# Altium schematic sheet power.SchDoc
size A4
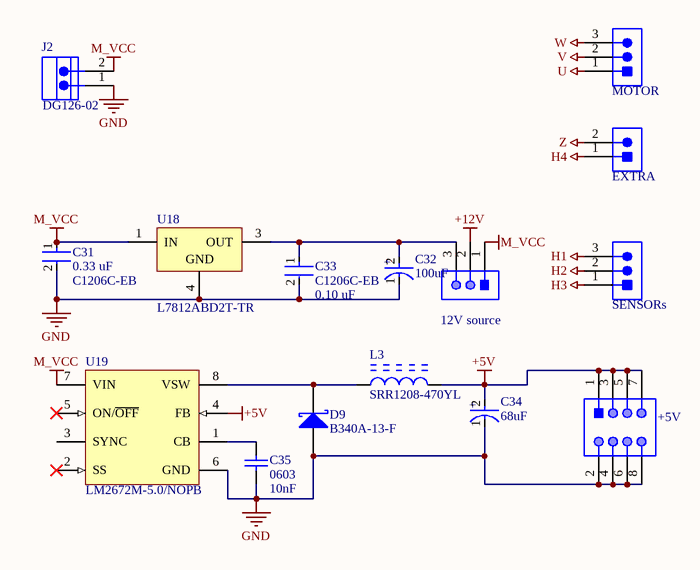
[diagram p0: power.SchDoc]

## Parts
12V_source  61300311121  [61300311121]  (value not drawn)
+5V  61300821121  [61300821121]  (value not drawn)
C31  Capacitance: 0.33 uF  Package: C1206C-EB  [FP-C1206C-EB-IPC_A]  (hidden comment: C1206C334M3VACTU)
C32  Capacitance: 100uF  [FP-PCR1J101MCL1GS-MFG]  (hidden comment: PCR1J101MCL1GS)
C33  Package: C1206C-EB  Capacitance: 0.10 uF  [FP-C1206C-EB-IPC_A]  (hidden comment: C1206C104KARACTU)
C34  Capacitance: 68uF  [FP-PCR1J101MCL1GS-MFG]  (hidden comment: PCR1J101MCL1GS)
C35  value 10nF  Case-EIA: 0603  [CAPC0603(1608)100_M]  (hidden comment: CAP 1nF 16V 0603(1608))
D9  B340A-13-F  [DIOD-SMA-2_V]
EXTRA  SCREW-5.0/5.08 2WAYS  [SCREW-5.0-2WAYS_V]  (value not drawn)
J2  DG126-02  [CXKF-KF129C-2_V]
L3  SRR1208-470YL  [BOUR-SRR1280-2_V]
MOTOR  SCREW-5.0/5.08 3WAYS  [SCREW-5.0-3WAYS_V]  (value not drawn)
SENSORs  SCREW-5.0/5.08 3WAYS  [SCREW-5.0-3WAYS_V]  (value not drawn)
U18  L7812ABD2T-TR  [TO-263_L]
U19  LM2672M-5.0/NOPB  [M08A_N]

## Nets
+5V: +5V.1 +5V.3 +5V.5 +5V.7 C34.2(A) L3.2 U19.4(FB)
+12V: 12V_source.2
GND: +5V.2 +5V.4 +5V.6 +5V.8 C31.2 C32.1(C) C33.2 C34.1(C) C35.1 D9.1(A) J2.1 U18.4(GND) U19.6(GND)
H1: SENSORs.3
H2: SENSORs.2
H3: SENSORs.1
H4: EXTRA.1
M_VCC: 12V_source.1 C31.1 J2.2 U18.1(IN) U19.7(VIN)
U: MOTOR.1
V: MOTOR.2
W: MOTOR.3
Z: EXTRA.2
Net12V_source_3: 12V_source.3 C32.2(A) C33.1 U18.3(OUT)
NetC35_2: C35.2 U19.1(CB)
NetD9_2: D9.2(K) L3.1 U19.8(VSW)

Not connected (* = marked no-connect by the designer): U19 2(SS)* 3(SYNC) 5(ON/~{OFF})*

## Notes on the sheet
- (in symbol CMP-12462-000005-1) +

## Library data of the parts
12V_source = CMP-1502-01062-1: THT Vertical Pin Header WR-PHD, Pitch 2.54 mm, Single Row, 3 pins; Manufacturer: Wurth Elektronik; Withstanding Voltage: 500VAC; Working Voltage: 250VAC; Rated Current: 3A; Pitch: 2.54mm; Pin Number: 3; Gender: Male; Contact Resistance: 20mOhm; Package Reference: 61300311121; Manufacturer URL: http://www.we-online.de; Datasheet URL: https://katalog.we-online.de/em/datasheet/6130xx11121.pdf; Operating Temperature: -40to105degC; Part Number: 61300311121; Orientation: Vertical; Packaging: Bag; Row Number: Single; Mounting Technology: THT; Publisher: WurthElektronik
+5V = CMP-1502-01078-1: THT Vertical Pin Header WR-PHD, Pitch 2.54 mm, Dual Row, 8 pins; Manufacturer: Wurth Elektronik; Contact Resistance: 20mOhm; Rated Current: 3A; Working Voltage: 250VAC; Pin Number: 8; Withstanding Voltage: 500VAC; Pitch: 2.54mm; Gender: Male; Datasheet URL: https://katalog.we-online.de/em/datasheet/6130xx21121.pdf; Package Reference: 61300821121; Orientation: Vertical; Part Number: 61300821121; Publisher: WurthElektronik; Mounting Technology: THT; Manufacturer URL: http://www.we-online.de; Packaging: Bag; Row Number: Dual; Operating Temperature: -40to105degC
C31 = CMP-03020-000898-1: CAP CER 0.33UF 25V Y5V 1206; Manufacturer: KEMET; Material: Ceramic; Value: 0.33 μF; Automotive Grade: Grade 0; Tolerance: 0.2; Temperature Coefficient: 15%; Ipc Land Pattern Name: CAPC320160X78; Height: 0.88mm; Automotive: Yes; Category: Cap; Manufacturer Part Number: C1206C334M3VACTU; Temperature Range High: +150°C; ComponentLink2URL: https://content.kemet.com/datasheets/KEM_C1007_X8R_ULTRA_150C_SMD.pdf; Device Class L3: Ceramic Capacitors; Device Class L2: Capacitors; Temperature: -55°C to +150°C; ComponentLink2Description: Datasheet; Mouser Description: Multilayer Ceramic Capacitors MLCC - SMD/SMT 25volts 0.33uF Y5V 20%; Octopart: https://octopart.com/c1206c334m3vactu-kemet-9139506; Temperature Characteristic: Y5V; Digikey Description: CAP CER 0.33UF 25V Y5V 1206; Voltage Rating: 25 V; Lead Free: Yes; RoHS: TRUE; Device Class L1: Passive Components; Temperature Range Low: -55°C
C32 C34 = CMP-12462-000005-1: CAP ALUM POLY 100UF 20% 63V SMD; Manufacturer: Nichicon; Ripple Current: 3000mA; Automotive Grade: Grade 1; Esr: 24mΩ; Dissipation Factor: 8%; Material: Aluminum; Life: 4000Hours; Leakage Current: 189uA; Voltage Rating: 63V; Device Class L1: Passive Components; Package: 0; Automotive: Yes; Manufacturer Part Number: PCR1J101MCL1GS; Device Class L3: Aluminum Electrolytic Capacitors; ComponentLink2URL: https://www.nichicon.co.jp/english/products/pdfs/e-pcr.pdf; Category: Cap; ComponentLink2Description: Datasheet; Lead Free: Yes; Tolerance: 20%; Digikey Description: CAP ALUM POLY 100UF 20% 63V SMD; Temperature: -55°C to +125°C; Temperature Range High: +125°C; Value: 100uF; Temperature Range Low: -55°C; Height: 12.7mm; Octopart: https://octopart.com/pcr1j101mcl1gs-nichicon-34508535; Device Class L2: Capacitors; Footprint Url: https://www.nichicon.co.jp/english/products/pdfs/e-p_ref.pdf; RoHS: TRUE
C33 = CMP-03020-000666-1: CAP CER 0.1UF 250V X7R 1206; Manufacturer: KEMET; Material: Ceramic; Temperature Coefficient: 15%; Value: 0.10 μF; Tolerance: 0.1; Automotive Grade: Grade 0; Mouser Description: Multilayer Ceramic Capacitors MLCC - SMD/SMT 250volts 0.1uF X7R 10%; Height: 0.88mm; Device Class L3: Ceramic Capacitors; Temperature Range Low: -55°C; Automotive: Yes; ComponentLink2Description: Datasheet; Category: Cap; RoHS: TRUE; Manufacturer Part Number: C1206C104KARACTU; Temperature Range High: +150°C; Device Class L2: Capacitors; Voltage Rating: 250 V; Lead Free: Yes; Temperature Characteristic: X7R; Digikey Description: CAP CER 0.1UF 250V X7R 1206; ComponentLink2URL: https://content.kemet.com/datasheets/KEM_C1007_X8R_ULTRA_150C_SMD.pdf; Device Class L1: Passive Components; Ipc Land Pattern Name: CAPC320160X78; Temperature: -55°C to +150°C; Octopart: https://octopart.com/c1206c104karactu-kemet-193627
C35 = CMP-1035-01877-1: CAP 1nF 16V ±2% 0603 (1608 Metric) Thickness 1mm SMD; Case-Metric: 1608; Tolerance: Â±2%; Max Thickness: 1 mm; Rated Voltage: 16 V; Technology: SMT
D9 = CMP-1667-00003-1: Surface Mount Schottky Barrier Rectifier, 40 V, 3 A, -55 to 150 degC, 2-Pin SMA, RoHS, Tape and Reel; Forward Current: 3 A; Forward Voltage: 500 mV; Max Surge Current: 80 A; Peak Reverse Current: 500 uA; Elements: 1; Mounting Technology: Surface Mount; ComponentLink1URL: http://www.diodes.com/; PackageDescription: 2-Pin Surface Mounted Assembly, Body 4.3 x 2.605 mm, Height 2.4 mm; Min Operating Temperature: -55 degC; Mount: Surface Mount; Pins: 2; ComponentLink2URL: http://www.diodes.com/_files/datasheets/ds30891.pdf; PackageReference: SMA-2; Max Operating Temperature: 125 degC; Radiation Hardening: No; Length: 4.6 mm; RoHSCompliant: true; ComponentLink1Description: Manufacturer URL; Height: 2.1 mm; ComponentLink2Description: Datasheet; Packaging: Tape and Reel; Package Quantity: 5000; Case\Package: SMA; DatasheetVersion: Rev. 17 - 2, 09/2015; REACH SVHC: No SVHC; Width: 2.92 mm
EXTRA = CMP-0617-00009-1: Socket, Screw Terminal Block, 2 Way, 5.0 mm Pitch, 90 Degree Angle, Through-Hole; Manufacturer: No Vendor; Insulation Resistance: 5000 MOhm / 1000 V; Contact Resistance: 20 mOhm; Rated Current: 25 A; Poles: 2; Rated Voltage: 300 V; PartNumber: SCREW-5.0/5.08 2WAYS; ComponentLink1Description: Datasheet; ComponentLink1URL: 5mm screw terminal in SVN; Mounting Technology: Through Hole; PackageDescription: Socket, Screw Terminal Block, 2 Way, Pitch 5 mm, 90 Degree Angle, Through-Hole; Temperature Range: -40 to 105 degC
J2 = CMP-0813-00004-1: Euro Terminal Block, 20 A, 300 V, -40 to 105 degC, Pitch 5 mm, 1 x 2 Position, Height 19.2 mm, Tail Length 3.5 mm; PartNumber: KF129C-02P-14; Manufacturer: Cixi KaiFeng; Insulation Resistance: 5000 MOhm / 1000 V; Pitch: Single Pitch; No. of Pole: 2; Rated Voltage: 300 V; Contact: Brass; Rated Current: 20 A; Contact Resistance: 20 mOhm; Withstanding Voltage: AC 1500 V / 1 Min; ComponentLink2Description: Datasheet; PackageReference: KF129C-2; ComponentLink1URL: http://www.nb-kaifeng.com/; ComponentLink2URL: http://www.nb-kaifeng.com/upload/editor/ext_pdf/201208170644598657.pdf; Color: Green; PackageDescription: Terminal Block, Pitch 5 mm, 1 x 2 Position, Height 19.2 mm, Tail Length 3.5 mm; Temp. Range: -40 to 105 degC; Mounting Technology: Through Hole; ComponentLink1Description: Manufacturer URL
L3 = CMP-2000-07147-1: Semi-Shielded Power Inductor, 100 uH, +/- 20%, 2.1 A, -40 to 125 degC, 2-Pin SMD, RoHS, Tape and Reel; Manufacturer: Bourns; Frequency - Self Resonant: 4.5MHz; Frequency - Test: 100kHz; Material - Core: Ferrite; EDA / CAD Models: DownloadfromAcceleratedDesigns; Other Names: SRR1280-101MTR / SRR1280101M; Q @ Freq: 18@796kHz; Product Training Modules: MagneticProductOverview; Current Rating: 2.1A; Inductance: 100µH; PCN Design/Specification: SRR12(6,8,1)0,PM12(5,7)SHModels17/Aug/2011; Online Catalog: SRRSeries; Type: Wirewound; PCN Assembly/Origin: MagneticproductsOct/2013; 3D Model: SRR1208.stp; Current - Saturation: 2A; DC Resistance (DCR): 150mOhmMax; Mounting Type: SurfaceMount; RoHS Information: SRR1280SeriesMaterialDeclaration; Manufacturer URL: http://www.bourns.com/; Packaging: Tape&Reel(TR); Package URL: http://www.bourns.com/docs/Product-Datasheets/SRR1280.pdf; Package / Case: Nonstandard; Datasheet URL: http://www.bourns.com/pdfs/SRR1280.pdf; Mounting Technology: SurfaceMount; Operating Temperature: -40°C~125°C; Shielding: Shielded; Category: Inductors,Coils,Chokes; Tolerance: ±20%; Package Reference: SRR1280-2; Datasheet Version: 03/2015; Family: FixedInductors; Package Description: 2-Pin Surface Mount Device, Body 12.5 x 12.5 mm; Series: SRR1280; Standard Package: 400
MOTOR SENSORs = CMP-0617-00010-1: Socket, Screw Terminal Block, 3 Way, 5.0 mm Pitch, 90 Degree Angle, Through-Hole; Manufacturer: No Vendor; Insulation Resistance: 5000 MOhm / 1000 V; Rated Voltage: 300 V; Poles: 3; Contact Resistance: 20 mOhm; Rated Current: 25 A; PartNumber: SCREW-5.0/5.08 3WAYS; PackageDescription: Socket, Screw Terminal Block, 3 Way, Pitch 5 mm, 90 Degree Angle, Through-Hole; Temperature Range: -40 to 105 degC; ComponentLink1Description: Datasheet; ComponentLink1URL: 5mm screw terminal in SVN; Mounting Technology: Through Hole
U18 = CMP-0244-00181-1: Positive Voltage Regulator, 3-Pin D2PAK, Tape and Reel; ComponentLink1Description: Manufacturer URL; ComponentLink2URL: http://www.st.com/internet/com/TECHNICAL_RESOURCES/TECHNICAL_LITERATURE/DATASHEET/CD00000444.pdf; PackageVersion: 2011; PackageDescription: 3-Pin Transistor Outline Package 2.54 mm Pitch, 15.4 mm Lead Span (D2PAK); DatasheetVersion: 16/11/2011; PackageReference: TO-263; ComponentLink1URL: http://www.st.com; ComponentLink2Description: Datasheet
U19 = CMP-0069-00668-1: SIMPLE SWITCHER® Power Converter High Efficiency 1A Step-Down Voltage Regulator with Features, 8-pin Narrow SOIC, Pb-Free; Manufacturer: National Semiconductor; PowerWise: N; PackageTopMarking: NSZXTT*2672*M5.0; PackageReference: M08A; CompType: Switcher; Code_IPC: SOIC127P600-8; PackageDescription: SOIC Narrow, 4.9 x 3.9 x 1.45mm, 8 Lead, 1.27mm Pitch; Code_JEDEC: MS-012-AA; RoHS: Y; PackageVersion: revM, May-2009; DatasheetVersion: Apr-2007; PinCount: 8